# EAGLE schematic ESP Thermometer (EAGLE 9.6.2)
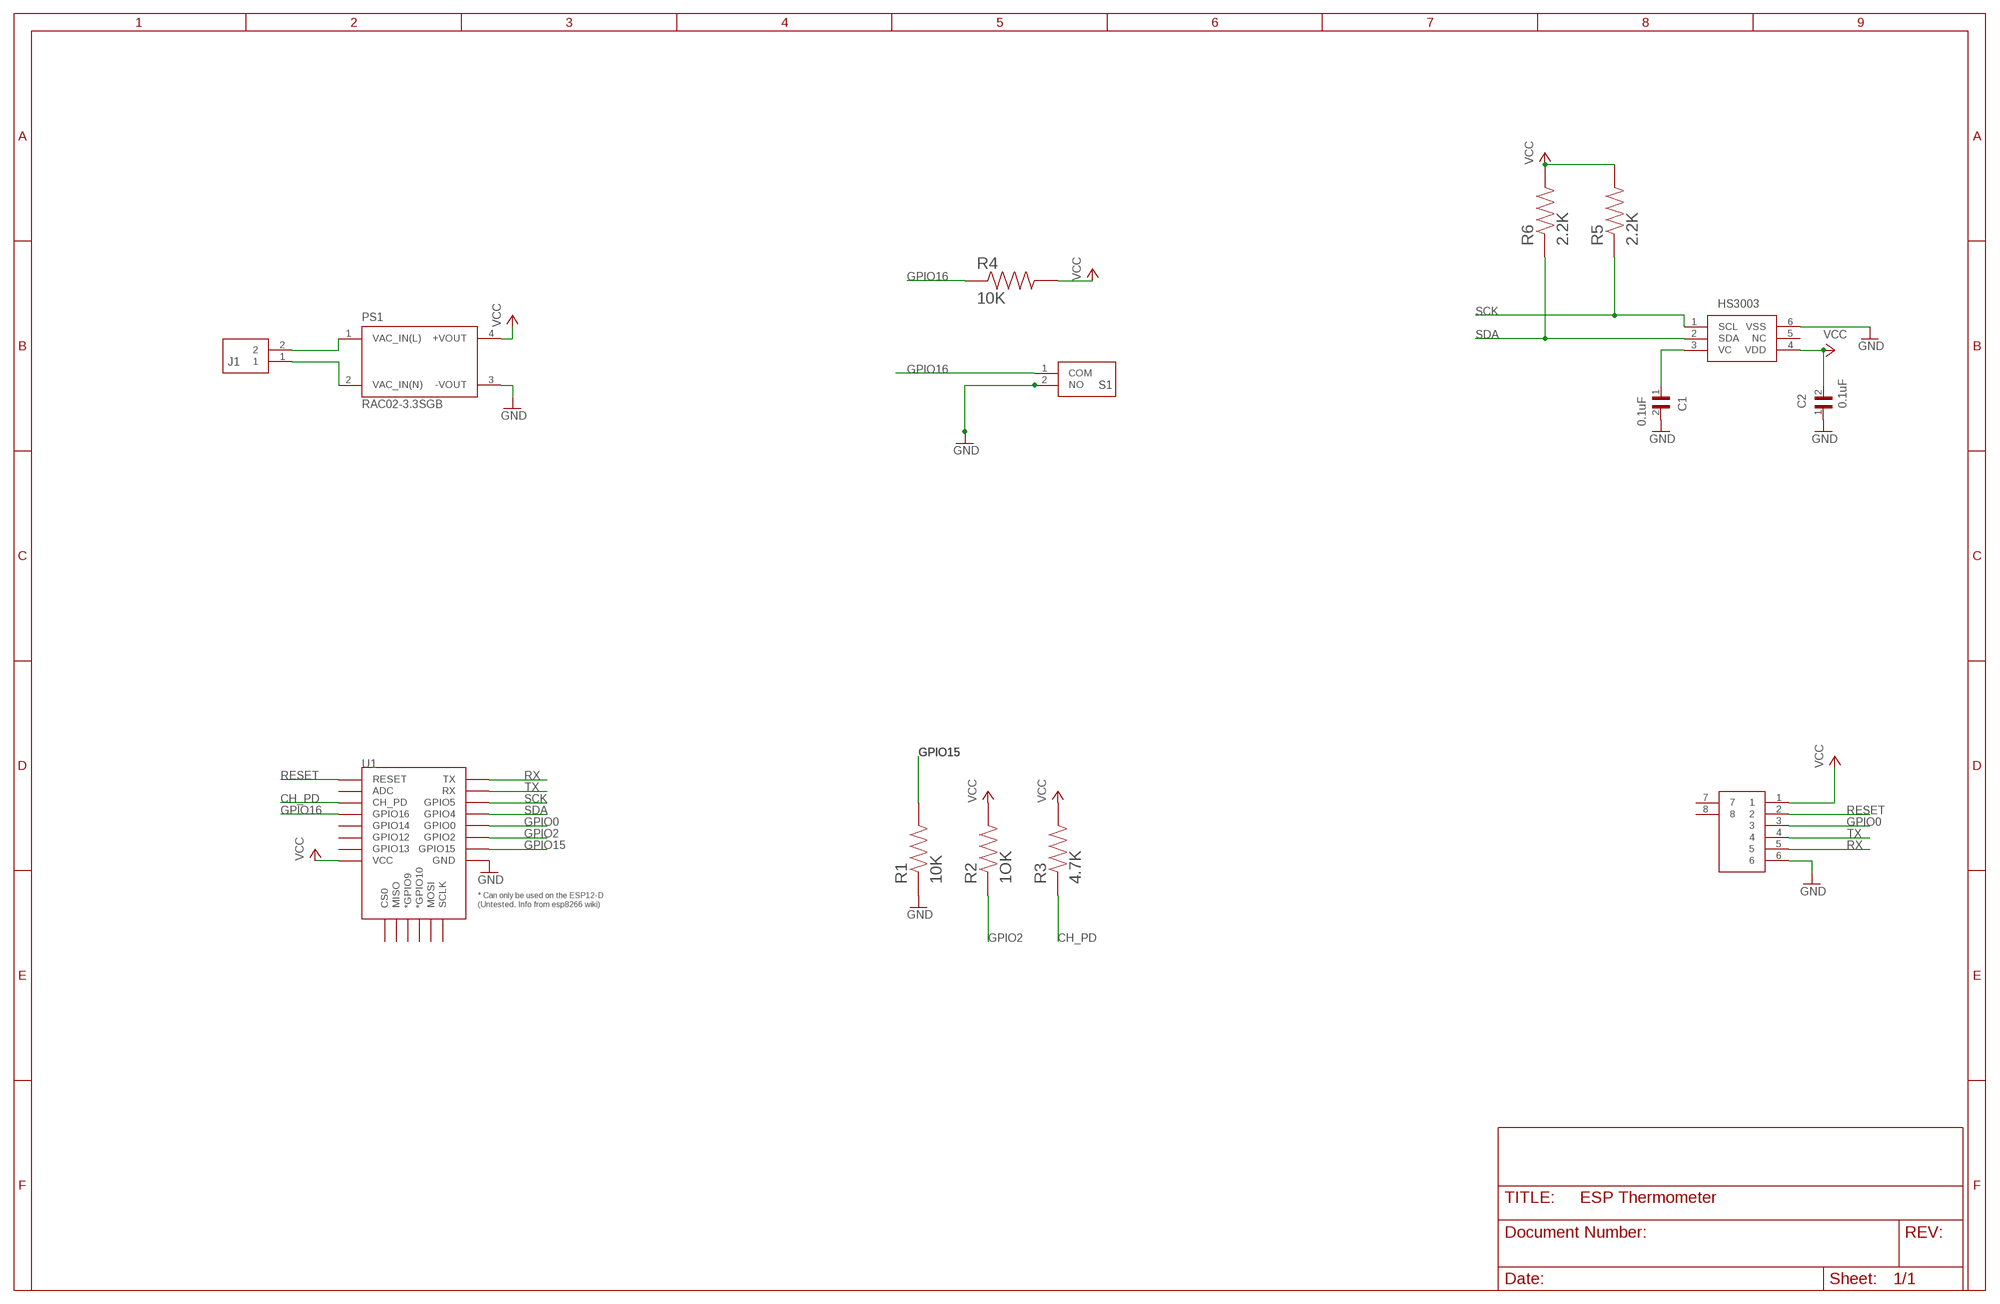
[diagram p0: schematic, sheet 1]

## Parts
C1  0.1uF  0805YC103J4T2A  [CAPC2012X94N]
C2  0.1uF  0805YC103J4T2A  [CAPC2012X94N]
IC1  HS3003  [HS3004]
J1  TB006-508-02BE  [TB00650802BE]
J2  52852-0670  [528520670]
PS1  RAC02-3.3SGB  [CONV_RAC02-3.3SGB]
R1  10K  RC0805FR-07330RL  [RESC2012X60N]
R2  1OK  RC0805FR-07330RL  [RESC2012X60N]
R3  4.7K  RC0805FR-07330RL  [RESC2012X60N]
R4  10K  RC0805FR-07330RL  [RESC2012X60N]
R5  2.2K  RC0805FR-07330RL  [RESC2012X60N]
R6  2.2K  RC0805FR-07330RL  [RESC2012X60N]
S1  PTS636_SP50_SMTR_LFS  [PTS636SP50SMTRLFS]
U1  ESP12ESMD  [ESP12E-SMD]

## Nets
CH_PD: R3.1 U1.CH_PD
GND: C1.2 C2.1 IC1.6(VSS) J2.6 PS1.3(-VOUT) R1.1 S1.2(NO) U1.GND
GPIO0: J2.3 U1.GPIO0
GPIO2: R2.1 U1.GPIO2
GPIO15: R1.2 U1.GPIO15
GPIO16: R4.1 S1.1(COM) U1.GPIO16
N$1: J1.2 PS1.1(VAC_IN(L))
N$2: J1.1 PS1.2(VAC_IN(N))
N$3: C1.1 IC1.3(VC)
RESET: J2.2 U1.RESET
RX: J2.5 U1.TXD0(TX)
SCK: IC1.1(SCL) R5.1 U1.GPIO5
SDA: IC1.2(SDA) R6.1 U1.GPIO4
TX: J2.4 U1.RXD0(RX)
VCC: C2.2 IC1.4(VDD) J2.1 PS1.4(+VOUT) R2.2 R3.2 R4.2 R5.2 R6.2 U1.VCC
Unconnected: IC1.5(NC) J2.7 J2.8 U1.ADC U1.CS0 U1.GPIO9(*GPIO9) U1.GPIO10(*GPIO10) U1.GPIO12 U1.GPIO13 U1.GPIO14 U1.MISO U1.MOSI U1.SCLK

## Library data of the parts
C1 C2 = 0805YC103J4T2A:0805YC103J4T2A: Cap Ceramic 0.01uF 16V X7R 5% SMD 0805 125°C Paper T/R Check availability <https://pricing.snapeda.com/parts/0805YC103J4T2A/AVX/view-part?ref=eda>; AVAILABILITY: In Stock; DESCRIPTION: 10000 pF ±5% 16V Ceramic Capacitor X7R 0805 (2012 Metric); MF: AVX; MP: 0805YC103J4T2A; PACKAGE: 2012 AVX; PRICE: None; PURCHASE-URL: https://pricing.snapeda.com/search/part/0805YC103J4T2A/?ref=eda
IC1 = HS3003:HS3003: The HS3003 is a highly-accurate, fully-calibrated relative humidity and temperature sensor. The high accuracy, fast measurement response time, and long-term stability, along with the small package size, makes the HS3003 ideal for a wide number of applications from portable to harsh environments.An integrated calibration and temperature compensation logic provides fully corrected RH and T values via a standard ICoutput. The measured data is internally corrected and compensated for accurate operation over a Source: Datasheet <https://www.idt.com/document/dst/hs300x-datasheet>; DESCRIPTION: The HS3003 is a highly-accurate, fully-calibrated relative humidity and temperature sensor. The high accuracy, fast measurement response time, and long-term stability, along with the small package size, makes the HS3003 ideal for a wide number of applications from portable to harsh environments.An integrated calibration and temperature compensation logic provides fully corrected RH and T values via a standard ICoutput. The measured data is internally corrected and compensated for accurate operation over a; HEIGHT: 0.9mm; MANUFACTURER_NAME: Renesas Electronics; MANUFACTURER_PART_NUMBER: HS3003; MOUSER_PART_NUMBER: 972-HS3003; MOUSER_PRICE-STOCK: https://www.mouser.co.uk/ProductDetail/Renesas-Electronics/HS3003?qs=1mbolxNpo8dE0wHdd8IyGw%3D%3D
J1 = TB006-508-02BE:TB006-508-02BE: Fixed Terminal Blocks screw type, 5.08 , horizontal, 2 poles, CUI Blue, slotted screw, PCB mount Source: Datasheet; DESCRIPTION: Fixed Terminal Blocks screw type, 5.08 , horizontal, 2 poles, CUI Blue, slotted screw, PCB mount; HEIGHT: 10.4mm; MANUFACTURER_NAME: CUI Inc.; MANUFACTURER_PART_NUMBER: TB006-508-02BE; MOUSER_PART_NUMBER: 490-TB006-508-02BE; MOUSER_PRICE-STOCK: https://www.mouser.co.uk/ProductDetail/CUI-Devices/TB006-508-02BE?qs=vLWxofP3U2wEdOVV%2FaT04w%3D%3D
J2 = 52852-0670:52852-0670: FFC & FPC Connectors 1.0 FFC Non ZIF SMT HsgAssy6CktEmbsTpPkg Source: Datasheet <https://www.molex.com/pdm_docs/sd/528520670_sd.pdf>; DESCRIPTION: FFC & FPC Connectors 1.0 FFC Non ZIF SMT HsgAssy6CktEmbsTpPkg; HEIGHT: 3mm; MANUFACTURER_NAME: Molex; MANUFACTURER_PART_NUMBER: 52852-0670; MOUSER_PART_NUMBER: 538-52852-0670; MOUSER_PRICE-STOCK: https://www.mouser.co.uk/ProductDetail/Molex/52852-0670?qs=%252BdbFUiYBkDZQc5IPgvIwgQ%3D%3D
PS1 = RAC02-3.3SGB:RAC02-3.3SGB: AC/DC Converter, 2 Watt, Single Output, EMC Class B Check prices <https://pricing.snapeda.com/parts/RAC02-3.3SGB/Recom%20Power/view-part?ref=eda>; DESCRIPTION: 2W AC/DC-Converter 'POWERLINE' 3kV reg; MF: Recom Power; MP: RAC02-3.3SGB; PACKAGE: DIP-4 Recom Power; PRICE: None
R1-R6 = RC0805FR-07330RL:RC0805FR-07330RL: Resistor SMD [YAGEO] RC0805FR-07330RL Resistor SMD Check availability <https://pricing.snapeda.com/parts/RC0805FR-07330RL/Yageo/view-part?ref=eda>; AVAILABILITY: In Stock; DESCRIPTION: 330 Ohms ±1% 0.125W, 1/8W Chip Resistor 0805 (2012 Metric) Moisture Resistant Thick Film; MF: Yageo; MP: RC0805FR-07330RL; PACKAGE: 2012 Rohm Semiconductor; PRICE: None; PURCHASE-URL: https://pricing.snapeda.com/search/part/RC0805FR-07330RL/?ref=eda
S1 = PTS636_SP50_SMTR_LFS:PTS636_SP50_SMTR_LFS: Tactile Switches Tact 50mA 12VDC, 6.0x3.5, 5.0mm H, 320gf, G leads, No ground pin, Black Actuator Source: Datasheet <https://componentsearchengine.com/Datasheets/1/PTS636 SP50 SMTR LFS.pdf>; DESCRIPTION: Tactile Switches Tact 50mA 12VDC, 6.0x3.5, 5.0mm H, 320gf, G leads, No ground pin, Black Actuator; HEIGHT: 5.2mm; MANUFACTURER_NAME: C & K COMPONENTS; MANUFACTURER_PART_NUMBER: PTS636 SP50 SMTR LFS; MOUSER_PART_NUMBER: 611-PTS636SP50SMTRLF; MOUSER_PRICE-STOCK: https://www.mouser.co.uk/ProductDetail/CK/PTS636-SP50-SMTR-LFS/?qs=vLWxofP3U2yQrwr1QnrRJw%3D%3D
U1 = esp8266modules:ESP12E: ESP12E Module